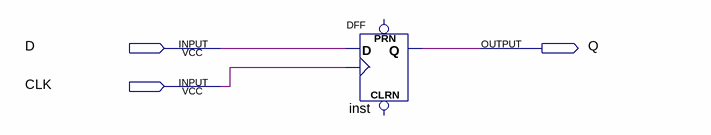
[diagram p0: schematic sheet]
// Quartus schematic Task7.bdf as structural Verilog: 1 symbols, 3 pins
module Task7 (
  input  D,
  input  CLK,
  output Q
);

  DFF inst (.CLK(CLK), .D(D), .Q(Q));  // open: CLRN, PRN
endmodule
